# Altium project Voltage detectV2.PrjPcb
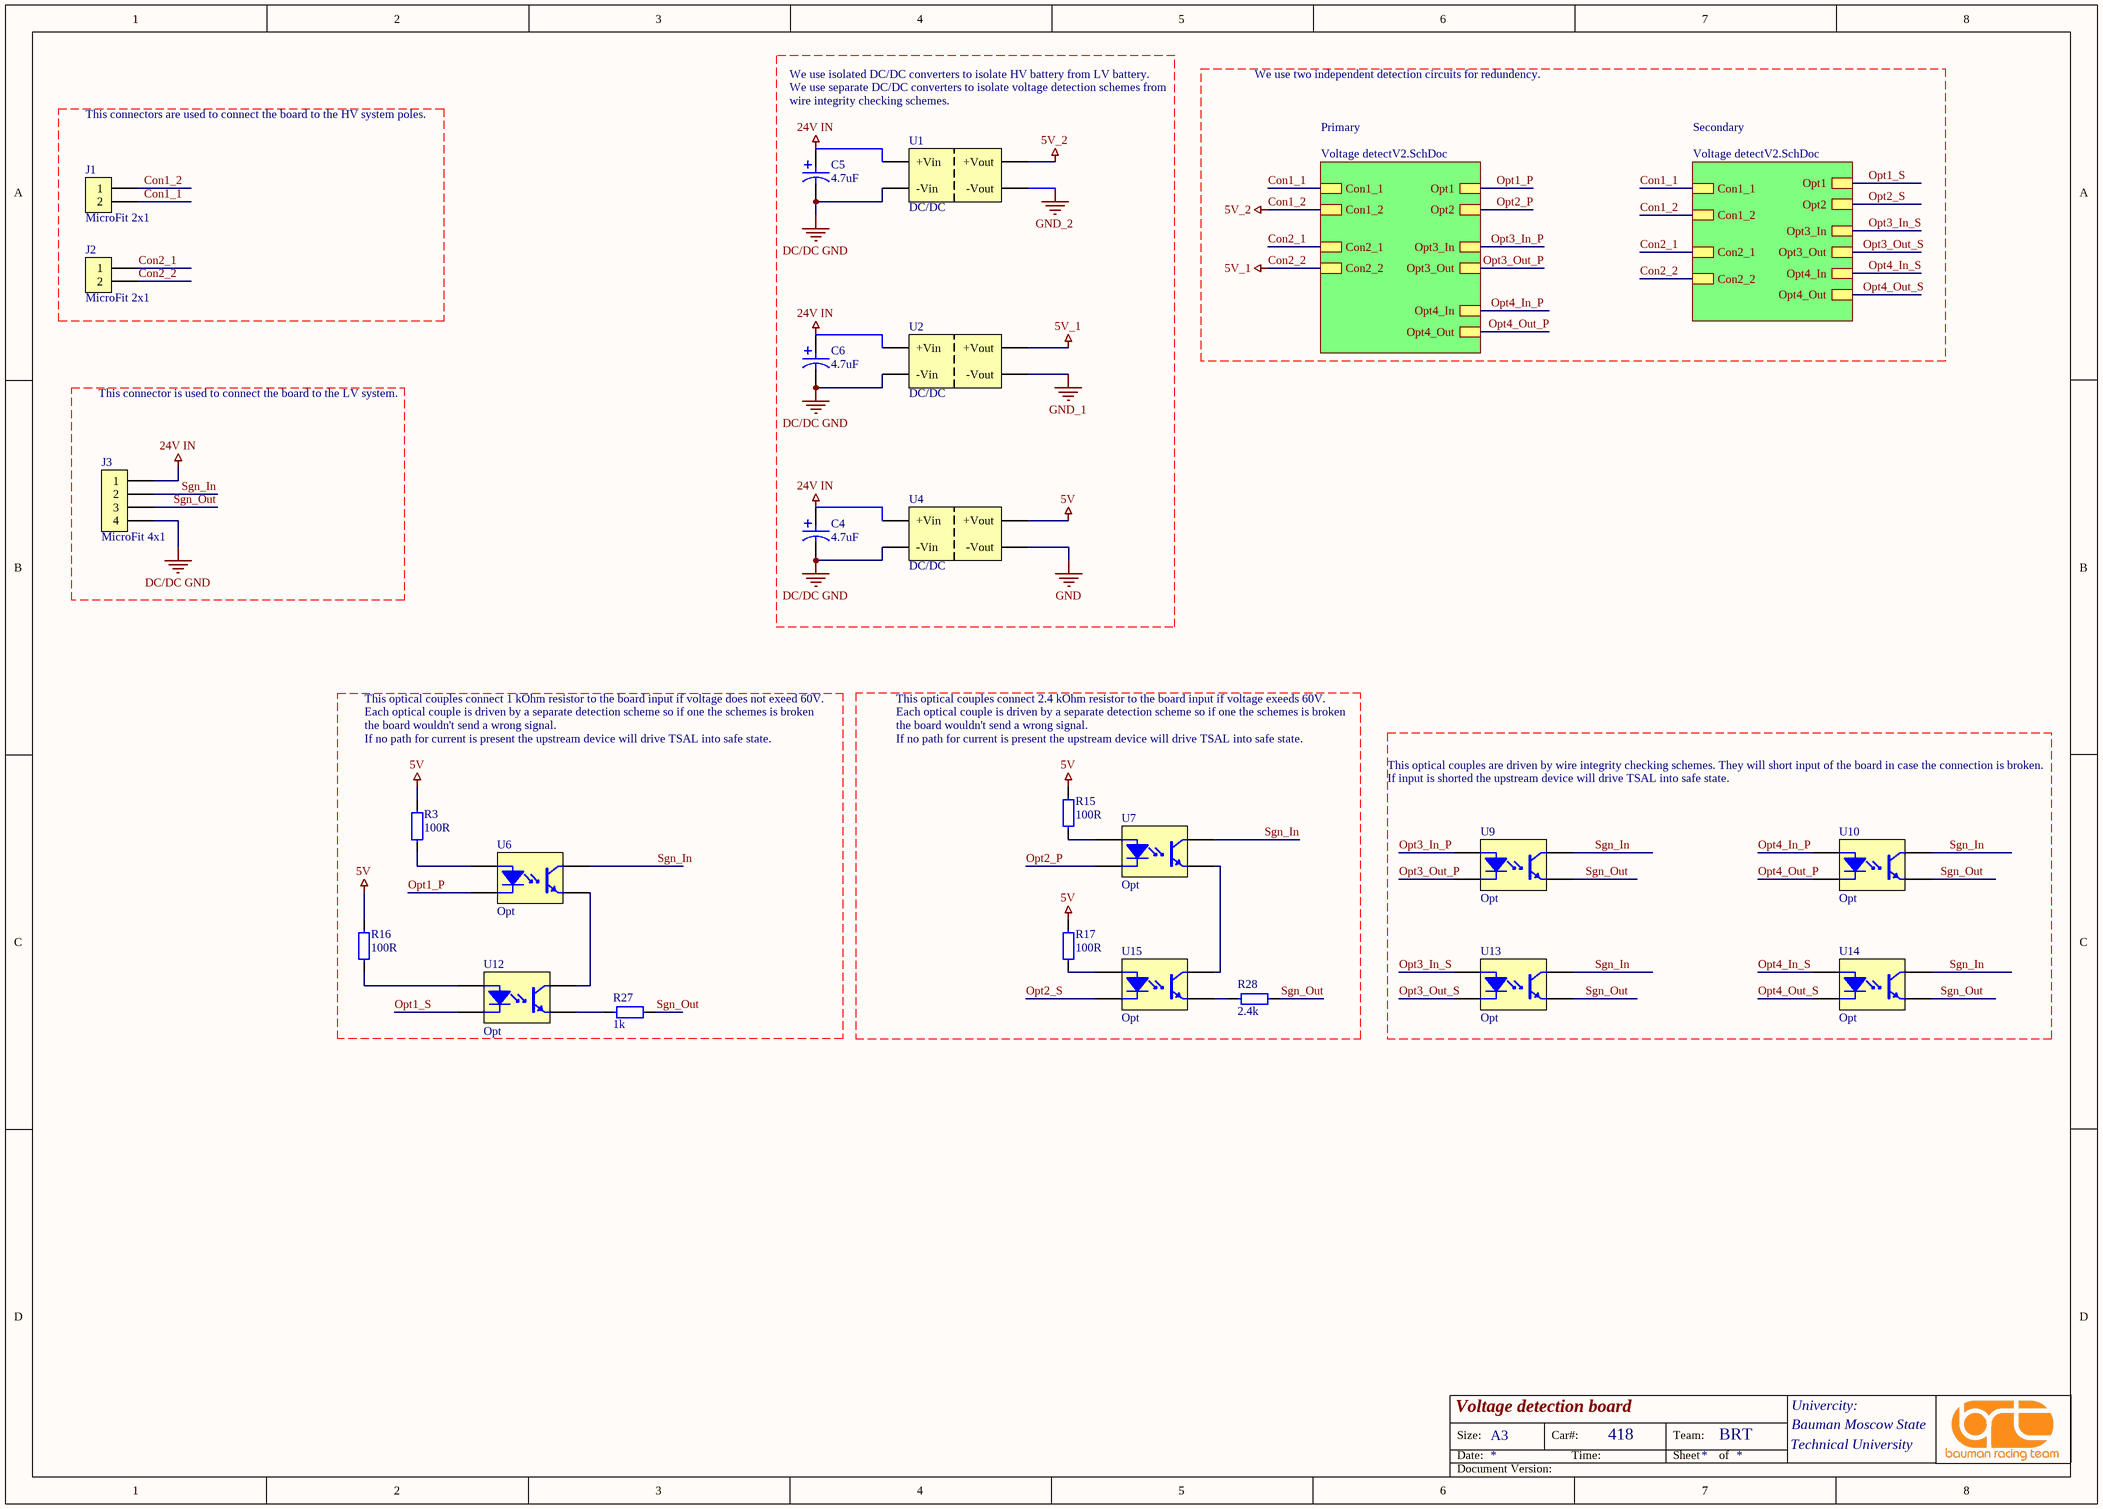
[diagram p0: main.SchDoc]
CAGE_CODE: ?????; CONTRACT_NUMBER: <CONTRACT NO>; DOC_NO_ASSY_DWG: <ASSY DWG NO>; DOC_NO_BOM: <BOM DOC NO>; DOC_NO_FAB_DWG: <FAB DWG NO>; DOC_NO_SCH_DWG: <SCH DWG NO>; PCB_2_DEC_TOL: +/-.01; PCB_3_DEC_TOL: +/-.010; PCB_ANG_TOL: +/-1/2; PCB_ASSEMBLY_NO: <PCB ASSY NO>; PCB_CHECKER: - -----; PCB_CHECKER_APP_DATE: --/--/----; PCB_DESIGNER: - -----; PCB_DESIGNER_APP_DATE: --/--/----; PCB_DWG_NO: <PCB DWG NO>; PCB_ENGINEER: - -----; PCB_ENGINEER_APP_DATE: --/--/----; PCB_PART_NUMBER: <PCB PN>; PCB_REV: A; SCH_REV: A
2 sheets, 85 parts. Net scope: hierarchical (ports join the sheet entries above them; power ports are global).
Board files: Voltage detect V3.PcbDoc, Voltage_Detect_Karen.PcbDoc, Voltage detect V4.PcbDoc
Sheets:
  main.SchDoc
    Primary = Voltage detectV2.SchDoc
    Secondary = Voltage detectV2.SchDoc

## Sheet main.SchDoc
size A3; Название устройства: Voltage detection board

### Parts
(Parts that share a designator on the sheet are numbered #1, #2 ... from top to bottom, then left to right.)
C4#1  4.7uF  [Bar Cap 4x5.4]
C5#1  4.7uF  [Bar Cap 4x5.4]
C6#1  4.7uF  [Bar Cap 4x5.4]
J1  MicroFit 2x1  [MolexMicroFit 2x1]
J2  MicroFit 2x1  [MolexMicroFit 2x1]
J3  MicroFit 4x1  [MolexMicroFit 4x1]
R3  100R  [0805 Resistor]
R15#1  100R  [0805 Resistor]
R16#1  100R  [0805 Resistor]
R17#1  100R  [0805 Resistor]
R27#1  1k  [0805 Resistor]
R28#1  2.4k  [0805 Resistor]
U1  DC/DC  [SIP7]
U2  DC/DC  [SIP7]
U4  DC/DC  [SIP7]
U6  Opt  [FAIR-MDIP-4_V]
U7  Opt  [FAIR-MDIP-4_V]
U9  Opt  [FAIR-MDIP-4_V]
U10  Opt  [FAIR-MDIP-4_V]
U12#1  Opt  [FAIR-MDIP-4_V]
U13#1  Opt  [FAIR-MDIP-4_V]
U14#1  Opt  [FAIR-MDIP-4_V]
U15#1  Opt  [FAIR-MDIP-4_V]

### Sub-sheets
Primary = Voltage detectV2.SchDoc: Opt2, Opt3_In, Opt1, Opt4_Out, Opt4_In, Con2_2, Opt3_Out, Con2_1, Con1_2, Con1_1
Secondary = Voltage detectV2.SchDoc: Opt2, Opt3_In, Opt1, Opt4_Out, Opt4_In, Con2_2, Opt3_Out, Con2_1, Con1_2, Con1_1

### Nets
5V: R3.2 R15#1.2 R16#1.2 R17#1.2 U4.6(+Vout)
24V IN: C4#1.2 C5#1.2 C6#1.2 J3.1 U1.1(+Vin) U2.1(+Vin) U4.1(+Vin)
Con1_2: J1.1 U1.6(+Vout) U9.1(ANODE) U13#1.1(ANODE) ; sheet Primary/Opt3_In, sheet Primary/Con1_2, sheet Secondary/Opt3_In, sheet Secondary/Con1_2  [also labelled 5V_2, Opt3_In_P, Opt3_In_S]
Con2_2: J2.2 U2.6(+Vout) U10.1(ANODE) U14#1.1(ANODE) ; sheet Primary/Opt4_In, sheet Primary/Con2_2, sheet Secondary/Opt4_In, sheet Secondary/Con2_2  [also labelled 5V_1, Opt4_In_P, Opt4_In_S]
DC/DC GND: C4#1.1 C5#1.1 C6#1.1 J3.4 U1.2(-Vin) U2.2(-Vin) U4.2(-Vin)
GND: U4.4(-Vout)  [project net  GND]
GND_1: U2.4(-Vout)
GND_2: U1.4(-Vout)
Con1_1: J1.2 ; sheet Primary/Con1_1, sheet Secondary/Con1_1
Con2_1: J2.1 ; sheet Primary/Con2_1, sheet Secondary/Con2_1
Opt1_P: U6.2(CATHODE) ; sheet Primary/Opt1
Opt1_S: U12#1.2(CATHODE) ; sheet Secondary/Opt1
Opt2_P: U7.2(CATHODE) ; sheet Primary/Opt2
Opt2_S: U15#1.2(CATHODE) ; sheet Secondary/Opt2
Opt3_Out_P: U9.2(CATHODE) ; sheet Primary/Opt3_Out
Opt3_Out_S: U13#1.2(CATHODE) ; sheet Secondary/Opt3_Out
Opt4_Out_P: U10.2(CATHODE) ; sheet Primary/Opt4_Out
Opt4_Out_S: U14#1.2(CATHODE) ; sheet Secondary/Opt4_Out
Sgn_In: J3.2 U6.4(COLLECTOR) U7.4(COLLECTOR) U9.4(COLLECTOR) U10.4(COLLECTOR) U13#1.4(COLLECTOR) U14#1.4(COLLECTOR)
Sgn_Out: J3.3 R27#1.2 R28#1.2 U9.3(EMITTER) U10.3(EMITTER) U13#1.3(EMITTER) U14#1.3(EMITTER)
NetR3_1: R3.1 U6.1(ANODE)
NetR15#1_1: R15#1.1 U7.1(ANODE)
NetR16#1_1: R16#1.1 U12#1.1(ANODE)
NetR17#1_1: R17#1.1 U15#1.1(ANODE)
NetR27#1_1: R27#1.1 U12#1.3(EMITTER)
NetR28#1_1: R28#1.1 U15#1.3(EMITTER)
NetU6_3: U6.3(EMITTER) U12#1.4(COLLECTOR)
NetU7_3: U7.3(EMITTER) U15#1.4(COLLECTOR)

### Notes on the sheet
- We use isolated DC/DC converters to isolate HV battery from LV battery.
- We use separate DC/DC converters to isolate voltage detection schemes from
- wire integrity checking schemes.
- We use two independent detection circuits for redundency.
- This connectors are used to connect the board to the HV system poles.
- This connector is used to connect the board to the LV system.
- This optical couples connect 1 kOhm resistor to the board input if voltage does not exeed 60V.
- Each optical couple is driven by a separate detection scheme so if one the schemes is broken
- This optical couples connect 2.4 kOhm resistor to the board input if voltage exeeds 60V.
- the board wouldn't send a wrong signal.
- If no path for current is present the upstream device will drive TSAL into safe state.
- (near R15#1) If no path for current is present the upstream device will drive TSAL into safe state.
- This optical couples are driven by wire integrity checking schemes. They will short input of the board in case the connection is broken.
- If input is shorted the upstream device will drive TSAL into safe state.
- Size:
- Date:
- A3
- Car#:
- Time:
- 418
- Team:
- Sheet
- BRT
- of
- Technical University
- Univercity:
- Bauman Moscow State
- Document Version:

### Library data of the parts
C4#1 C5#1 C6#1 = Cap Pol 4.7uF: ECAP SMD,  35V, 105°C; Part Number: B41121A7475M000; Manufacturer: Epcos; Type: Capacitor; ComponentLink1Description: Chip&Dip; ComponentLink1URL: https://www.chipdip.ru/product/b41121a7475m000
J1 J2 = Conn 2 [MicroFit]: Micro-Fit 3.0 Right-Angle Header, 3.00mm Pitch, Single Row, 2 Circuits, with Snap-in Plastic Peg PCB Lock, Tin, Glow-Wire Capable, Black; Part Number: 436500200; Manufacturer: Molex; ComponentLink1Description: Molex; ComponentLink1URL: https://www.molex.com/molex/products/part-detail/pcb_headers/0436500200; Type: Connector
J3 = Conn 4 [MicroFit]: Micro-Fit 3.0 Right-Angle Header, 3.00mm Pitch, Single Row, 4 Circuits, with Snap-in Plastic Peg PCB Lock, Tin, Glow-Wire Capable, Black; Part Number: 436500400; Manufacturer: Molex; ComponentLink1Description: Molex; ComponentLink1URL: https://www.molex.com/molex/products/part-detail/pcb_headers/0436500400; Type: Connector
R3 R15#1 R16#1 R17#1 = Res 100R (0805): 0.125W 0805 100R, 1%; Part Number: RC0805FR-07100RL; Manufacturer: Taiwan; Type: Resistor; ComponentLink1Description: Chip&Dip; ComponentLink1URL: https://www.chipdip.ru/product0/9000079462
R27#1 = Res 1k (0805): 0.125W 0805 1k, 1%; Part Number: RC0805FR-071KL; Manufacturer: Taiwan; Type: Resistor; ComponentLink1Description: Chip&Dip; ComponentLink1URL: https://www.chipdip.ru/product0/9000079486
R28#1 = Res 2.4k (0805): 0.125W 0805 2.4k, 1%; Part Number: RC0805FR-072K4L; Manufacturer: Taiwan; Type: Resistor; ComponentLink1Description: Chip&Dip; ComponentLink1URL: https://www.chipdip.ru/product0/9000079495
U1 U2 U4 = DC/DC Isolated 24V-5V [TMH]: The TMH series are ultra miniature, isolated 2 Watt DC/DC-converters in a Single-in-Line  package  (SIP); Manufacturer: Traco Power; Part Number: TMH2405S; ComponentLink1Description: Chip&Dip; ComponentLink1URL: https://www.chipdip.ru/product/tmh-2405s; ComponentLink2Description: DataSheet; ComponentLink2URL: https://static.chipdip.ru/lib/005/DOC001005854.pdf; Type: IC
U6 U7 U9 U10 U12#1 U13#1 U14#1 U15#1 = Optocoupler [FOD817B]: Phototransistor Optocoupler, 4 us Rise, 3 us Fall, 5000 Vrms, -55 to 110 degC, 4-Pin MDIP, RoHS, Tape and Reel; Manufacturer: ON Semiconductor; Part Nomber: FOD817B; ComponentLink1Description: Chip&Dip; ComponentLink1URL: https://www.chipdip.ru/product/fod817b; ComponentLink2Description: DataSheet; ComponentLink2URL: https://static.chipdip.ru/lib/297/DOC000297284.pdf

## Sheet Voltage detectV2.SchDoc
size A4; ENG_APP_DATE: --/--/--; DSN_APP_DATE: --/--/--; CHK_APP_DATE: --/--/--; Название устройства: Voltage dect V2
Used 2 times, as channels Primary, Secondary. Parts and nets are listed once, with the designators drawn on the sheet.
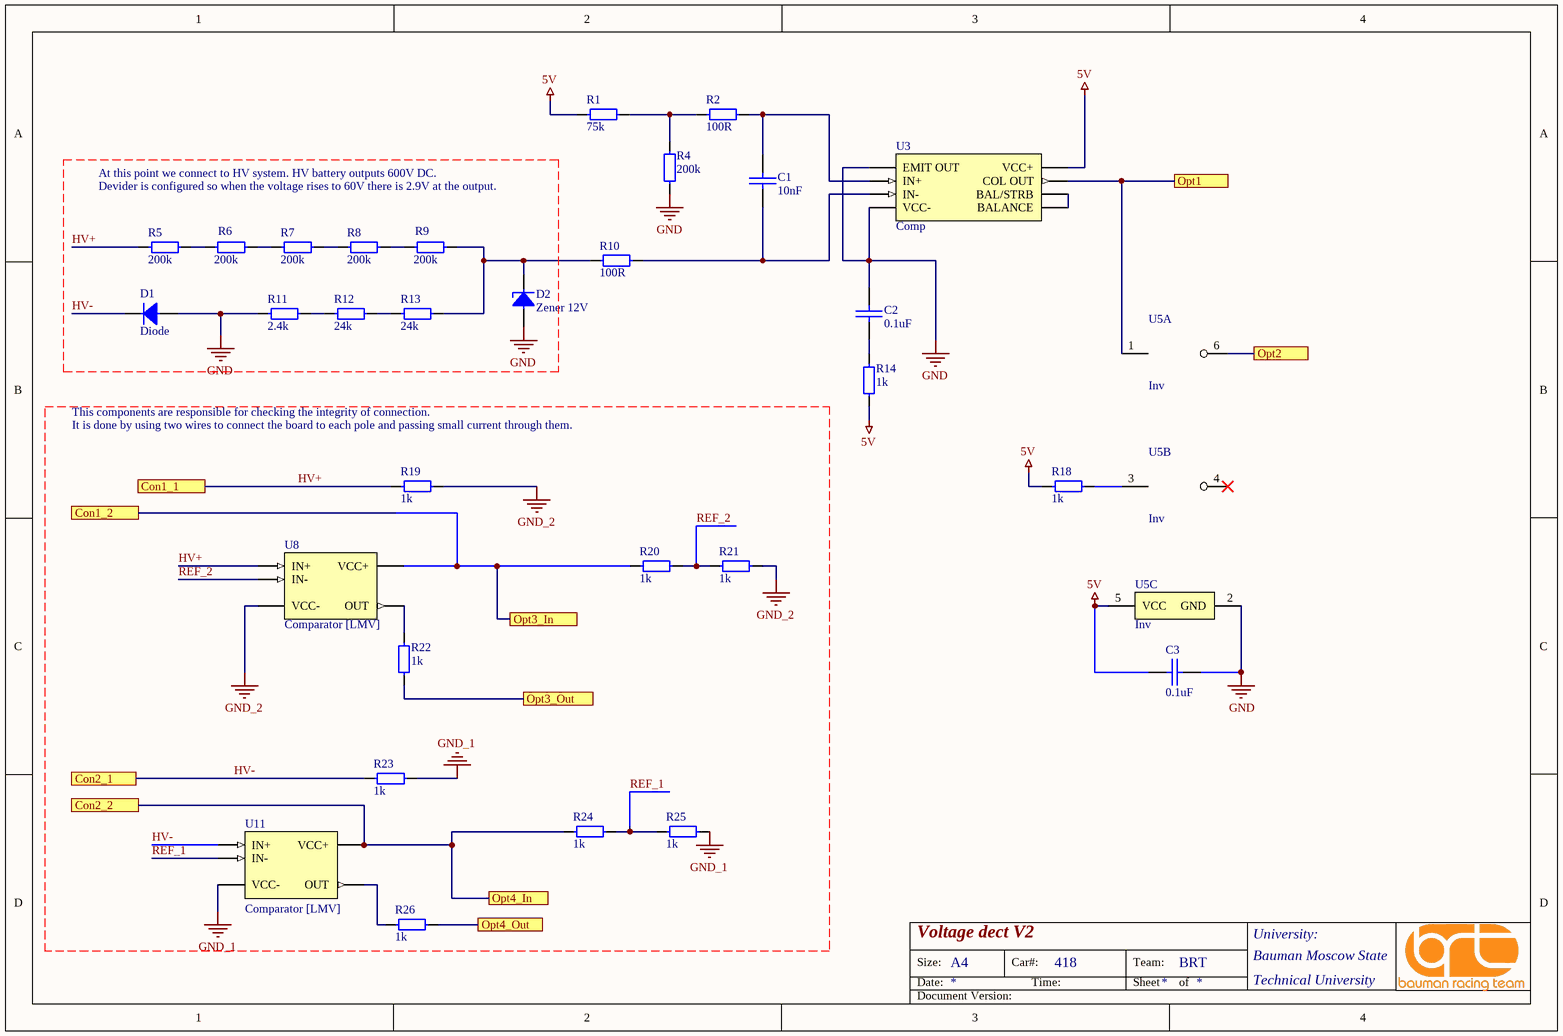
[diagram p1: Voltage detectV2.SchDoc]

### Parts
C1  10nF  [0805 Capicator]
C2  0.1uF  [0805 Capicator]
C3  0.1uF  [0805 Capicator]
D1  Diode  [DO-41]
D2  Zener 12V  [sod-323]
R1  75k  [0805 Resistor]
R2  100R  [0805 Resistor]
R4  200k  [0805 Resistor]
R5  200k  [0805 Resistor]
R6  200k  [0805 Resistor]
R7  200k  [0805 Resistor]
R8  200k  [0805 Resistor]
R9  200k  [0805 Resistor]
R10  100R  [0805 Resistor]
R11  2.4k  [0805 Resistor]
R12  24k  [0805 Resistor]
R13  24k  [0805 Resistor]
R14  1k  [0805 Resistor]
R18  1k  [0805 Resistor]
R19  1k  [0805 Resistor]
R20  1k  [0805 Resistor]
R21  1k  [0805 Resistor]
R22  1k  [0805 Resistor]
R23  1k  [0805 Resistor]
R24  1k  [0805 Resistor]
R25  1k  [0805 Resistor]
R26  1k  [0805 Resistor]
U3  Comp  [SOIC-8]
U5  Inv  [SOT236]  (parts A,B,C of 3)
U8  Comparator [LMV]  [SOT-23-5]
U11  Comparator [LMV]  [SOT-23-5]

### Ports
Con1_1, Con1_2, Con2_1, Con2_2, Opt1, Opt2, Opt3_In, Opt3_Out, Opt4_In, Opt4_Out

### Nets
5V: C3.1 R1.1 R14.1 R18.2 U3.8(VCC+) U5.5(VCC)
 GND: C2.2 C3.2 D1.1 D2.1 R4.1 R11.1 U3.1(EMIT_OUT) U3.4(VCC-) U5.2(GND)  [also labelled GND]
GND_1: R23.1 R25.1 U11.2(VCC-)
GND_2: R19.1 R21.1 U8.2(VCC-)
Con1_2: R20.2 U8.5(VCC+) ; port Opt3_In, port Con1_2
Con2_2: R24.2 U11.5(VCC+) ; port Con2_2, port Opt4_In
HV+: R5.1 R19.2 U8.1(IN+) ; port Con1_1
HV-: D1.2 R23.2 U11.1(IN+) ; port Con2_1
Opt1: U3.7(COL_OUT) U5.1(1A) ; port Opt1
Opt2: U5.6(1Y) ; port Opt2
Opt3_Out: R22.2 ; port Opt3_Out
Opt4_Out: R26.2 ; port Opt4_Out
REF_1: R24.1 R25.2 U11.3(IN-)
REF_2: R20.1 R21.2 U8.3(IN-)
NetC1_1: C1.1 R10.2 U3.3(IN-)
NetC1_2: C1.2 R2.2 U3.2(IN+)
NetC2_1: C2.1 R14.2
NetD2_2: D2.2 R9.2 R10.1 R13.2
NetR1_2: R1.2 R2.1 R4.2
NetR5_2: R5.2 R6.1
NetR6_2: R6.2 R7.1
NetR7_2: R7.2 R8.1
NetR8_2: R8.2 R9.1
NetR11_2: R11.2 R12.2
NetR12_1: R12.1 R13.1
NetR18_1: R18.1 U5.3(2А)
NetR22_1: R22.1 U8.4(OUT)
NetR26_1: R26.1 U11.4(OUT)
NetU3_5: U3.5(BALANCE) U3.6(BAL/STRB)

Not connected (* = marked no-connect by the designer): U5 4(2Y)*

### Channels
Primary: designators C1=C4#2 C2=C5#2 C3=C6#2 D1=D1 D2=D2 R1=R7 R2=R8 R4=R9 R5=R10 R6=R11 R7=R12 R8=R13 R9=R14 R10=R15#2 R11=R16#2 R12=R17#2 R13=R18 R14=R20 R18=R19 R19=R21 R20=R23 R21=R24 R22=R25 R23=R26 R24=R27#2 R25=R28#2 R26=R29 U3=U12#2 U5=U13#2 U8=U14#2 U11=U15#2; ports Con1_1=Con1_1 Con1_2=Con1_2 Con2_1=Con2_1 Con2_2=Con2_2 Opt1=Opt1_P Opt2=Opt2_P Opt3_In=Con1_2 Opt3_Out=Opt3_Out_P Opt4_In=Con2_2 Opt4_Out=Opt4_Out_P
Secondary: designators C1=C7 C2=C8 C3=C9 D1=D3 D2=D4 R1=R30 R2=R31 R4=R32 R5=R33 R6=R34 R7=R35 R8=R36 R9=R37 R10=R38 R11=R39 R12=R40 R13=R41 R14=R43 R18=R42 R19=R44 R20=R46 R21=R47 R22=R48 R23=R49 R24=R50 R25=R51 R26=R52 U3=U16 U5=U17 U8=U18 U11=U19; ports Con1_1=Con1_1 Con1_2=Con1_2 Con2_1=Con2_1 Con2_2=Con2_2 Opt1=Opt1_S Opt2=Opt2_S Opt3_In=Con1_2 Opt3_Out=Opt3_Out_S Opt4_In=Con2_2 Opt4_Out=Opt4_Out_S

### Notes on the sheet
- At this point we connect to HV system. HV battery outputs 600V DC.
- Devider is configured so when the voltage rises to 60V there is 2.9V at the output.
- This components are responsible for checking the integrity of connection.
- (near R19) It is done by using two wires to connect the board to each pole and passing small current through them.
- Size:
- Date:
- A4
- Car#:
- Time:
- 418
- Team:
- Sheet
- BRT
- of
- University:
- Technical University
- Bauman Moscow State
- Document Version:

### Library data of the parts
C1 = Cap 10nF (0805): 0805 X7R 10nF 100V 10%; Manufacturer: Murata Manufacturing; Part Number: GRM21BR72A103KA01L; Type: Capacitor; ComponentLink1Description: Chip&Dip; ComponentLink1URL: https://www.chipdip.ru/product/grm21br72a103ka01l
C2 C3 = Cap 0.1uF (0805): 0.1uF X7R 25V 10% 0805; Manufacturer: Murata Manufacturing; Part Number: GRM21BR71E104KA01L; Type: Capacitor; ComponentLink1Description: Chip&Dip; ComponentLink1URL: https://www.chipdip.ru/product/grm21br71e104ka01l
D1 = Diode HV [EM5]: Highg voltage diode - 2000V; Part Number: EM518; Manufacturer: China; ComponentLink1Description: ChipDip; ComponentLink1URL: https://www.chipdip.ru/product/em518; ComponentLink2Description: Datasheet; ComponentLink2URL: https://static.chipdip.ru/lib/004/DOC001004767.pdf; Type: Diode
D2 = Zener Diode 12V: 300mW; Part Number: BZX384-C12,115; Manufacturer: NXP Semiconductor; Type: Diode; ComponentLink1Description: Chip&Dip; ComponentLink1URL: https://www.chipdip.ru/product/bzx384-c12.115; ComponentLink2Description: DataSheet; ComponentLink2URL: https://static.chipdip.ru/lib/583/DOC001583013.pdf
R1 = Res 75k (0805): 0.125W 0805 75k, 1%; Part Number: RC0805FR-0775KL; Manufacturer: Taiwan; Type: Resistor; ComponentLink1Description: Chip&Dip; ComponentLink1URL: https://www.chipdip.ru/product0/9000079535
R2 R10 = Res 100R (0805): as R3 on sheet main; Type: Resistor; ComponentLink1Description: Chip&Dip; ComponentLink1URL: https://www.chipdip.ru/product0/9000079462
R4-R9 = Res 200k (0805): 0.125W 0805 200k, 1%; Part Number: RC0805FK-07200KL; Manufacturer: Taiwan; Type: Resistor; ComponentLink1Description: Chip&Dip; ComponentLink1URL: https://www.chipdip.ru/product0/914213016
R11 = Res 2.4k (0805): as R28#1 on sheet main; Type: Resistor; ComponentLink1Description: Chip&Dip; ComponentLink1URL: https://www.chipdip.ru/product0/9000079495
R12 R13 = Res 24k (0805): 0.125W 0805 24k, 1%; Part Number: RC0805FR-0724KL; Manufacturer: Taiwan; Type: Resistor; ComponentLink1Description: Chip&Dip; ComponentLink1URL: https://www.chipdip.ru/product0/9000079523
R14 R18-R26 = Res 1k (0805): as R27#1 on sheet main; Type: Resistor; ComponentLink1Description: Chip&Dip; ComponentLink1URL: https://www.chipdip.ru/product0/9000079486
U3 = Comparator [LM3]: Differential comparator with strobes; Part Number: LM311DR; Manufacturer: Texas Instruments; ComponentLink1Description: DataSheet; ComponentLink1URL: https://static.chipdip.ru/lib/222/DOC000222396.pdf; ComponentLink2Description: Chip&Dip; ComponentLink2URL: https://www.chipdip.ru/product/lm311d; Type: IC
U5 = Inverter (SN74): Dual inverter, 1.65-5.5V; Manufacturer: Texas Instruments; Part Number: SN74LVC2G04DBVR; ComponentLink1Description: Chip&Dip; ComponentLink1URL: https://www.chipdip.ru/product/sn74lvc2g04dbvr-2; ComponentLink2Description: DataSheet; ComponentLink2URL: https://static.chipdip.ru/lib/021/DOC001021810.pdf; Type: IC
U8 U11 = Comparator [LMV]: Differential comparator with strobes; Part Number: LMV331M5/NOPB; Manufacturer: Texas Instruments; ComponentLink2URL: https://www.chipdip.ru/product/lmv331m5-nopb; ComponentLink1URL: https://static.chipdip.ru/lib/291/DOC000291302.pdf; ComponentLink1Description: DataSheet; ComponentLink2Description: Chip&Dip; Type: IC

## Nets that join several sheets
5V: main (5 pins), Primary (6 pins), Secondary (6 pins)
 GND: main (U4.4), Primary (9 pins), Secondary (9 pins)
Con1_2: main (J1.1 U1.6 U9.1 U13#1.1), Primary (R23.2 U14#2.5), Secondary (R46.2 U18.5)
Con2_2: main (J2.2 U2.6 U10.1 U14#1.1), Primary (R27#2.2 U15#2.5), Secondary (R50.2 U19.5)
GND_1: main (U2.4), Primary (R26.1 R28#2.1 U15#2.2), Secondary (R49.1 R51.1 U19.2)
GND_2: main (U1.4), Primary (R21.1 R24.1 U14#2.2), Secondary (R44.1 R47.1 U18.2)
Con1_1: main (J1.2), Primary (R10.1 R21.2 U14#2.1), Secondary (R33.1 R44.2 U18.1)
Con2_1: main (J2.1), Primary (D1.2 R26.2 U15#2.1), Secondary (D3.2 R49.2 U19.1)
Opt1_P: main (U6.2), Primary (U12#2.7 U13#2.1)
Opt1_S: main (U12#1.2), Secondary (U16.7 U17.1)
Opt2_P: main (U7.2), Primary (U13#2.6)
Opt2_S: main (U15#1.2), Secondary (U17.6)
Opt3_Out_P: main (U9.2), Primary (R25.2)
Opt3_Out_S: main (U13#1.2), Secondary (R48.2)
Opt4_Out_P: main (U10.2), Primary (R29.2)
Opt4_Out_S: main (U14#1.2), Secondary (R52.2)